# EAGLE schematic LilyTiny_PB (EAGLE 6.0)
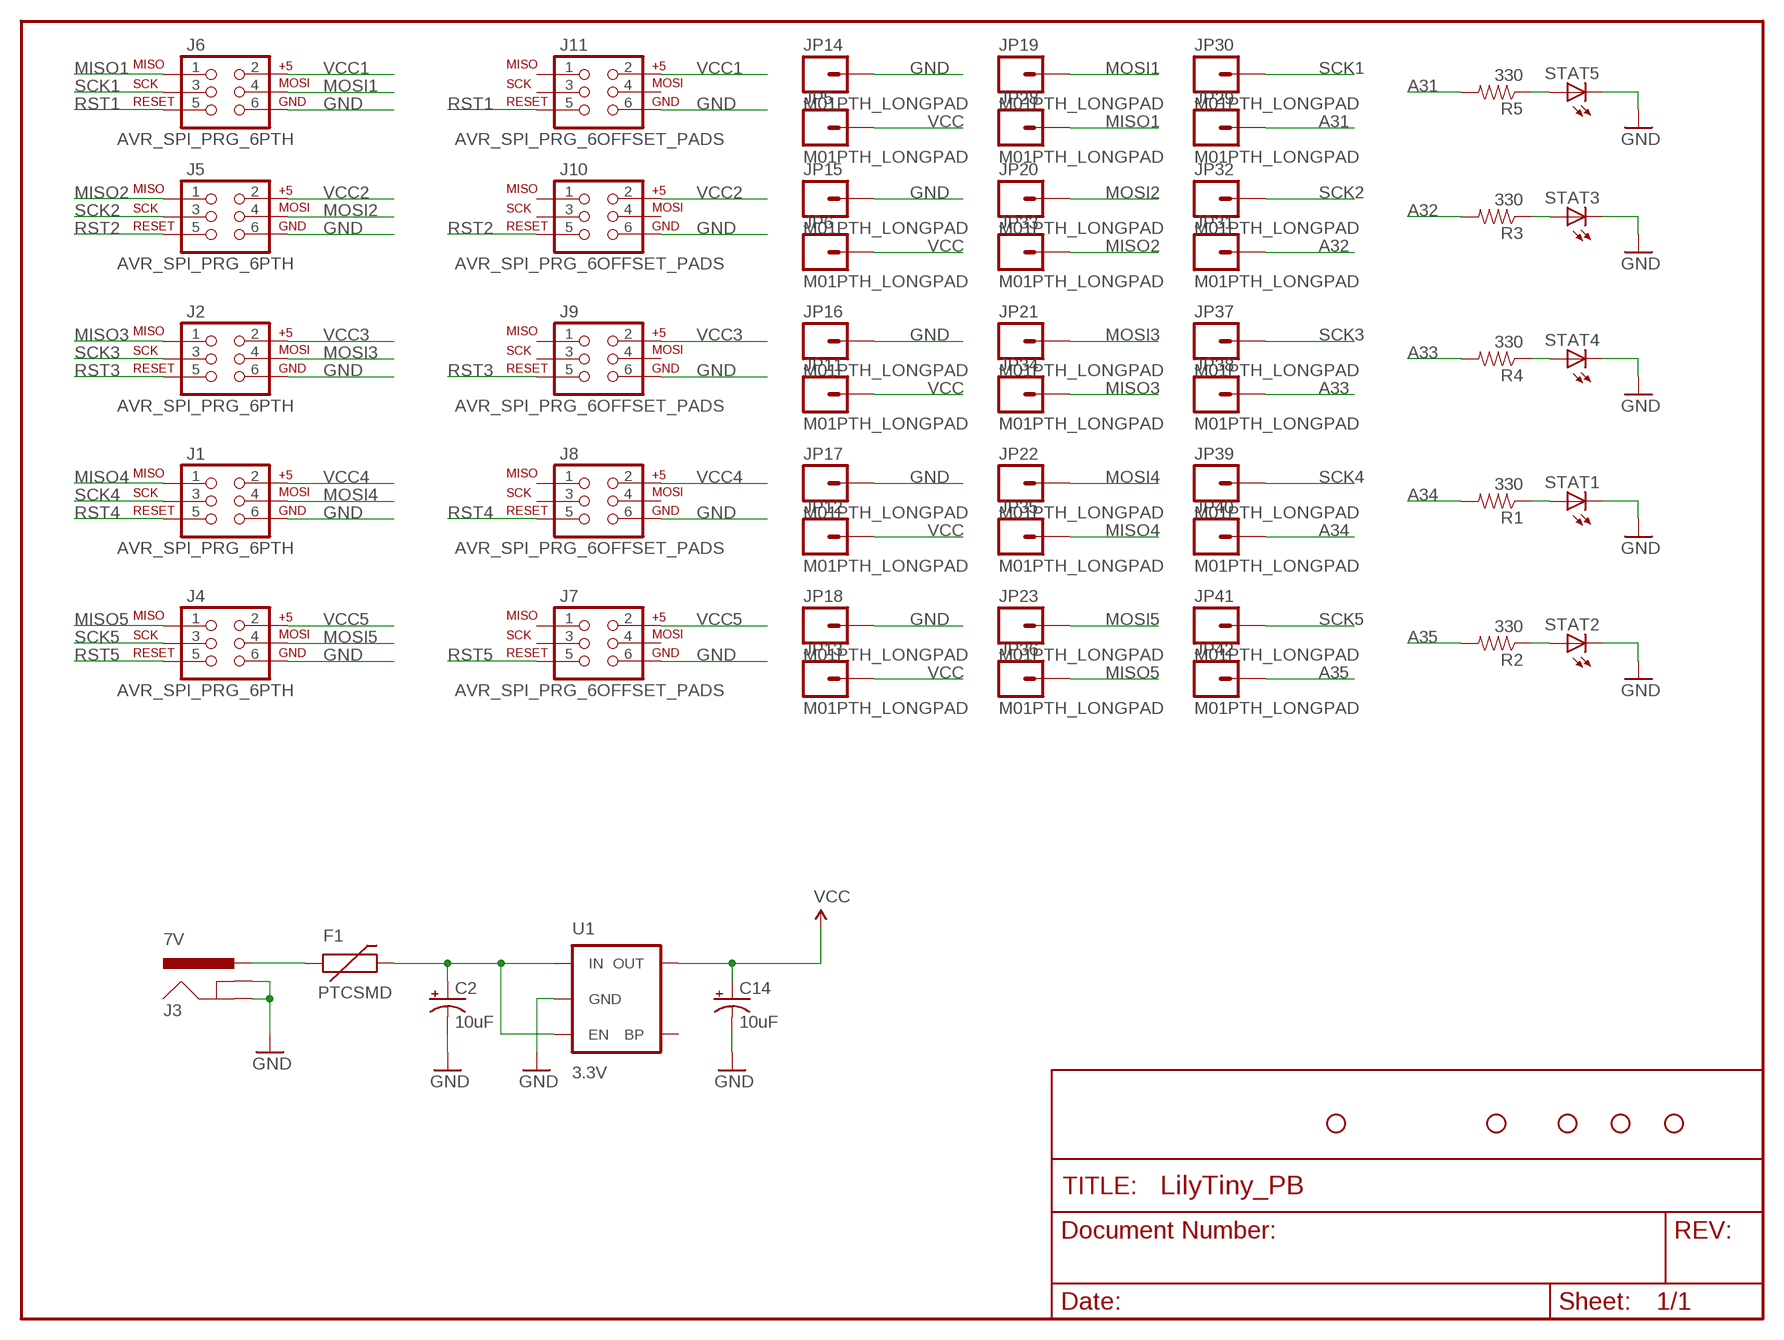
[diagram p0: schematic, sheet 1]

## Parts
C2  10uF  CAP_POL1206  [EIA3216]
C14  10uF  CAP_POL1206  [EIA3216]
F1  PTCSMD  [PTC-1206]
J1  AVR_SPI_PRG_6PTH  [2X3]
J2  AVR_SPI_PRG_6PTH  [2X3]
J3  7V  POWER_JACKPTH_LOCK  [POWER_JACK_PTH_LOCK]
J4  AVR_SPI_PRG_6PTH  [2X3]
J5  AVR_SPI_PRG_6PTH  [2X3]
J6  AVR_SPI_PRG_6PTH  [2X3]
J7  AVR_SPI_PRG_6OFFSET_PADS  [2X3_OFFSET]
J8  AVR_SPI_PRG_6OFFSET_PADS  [2X3_OFFSET]
J9  AVR_SPI_PRG_6OFFSET_PADS  [2X3_OFFSET]
J10  AVR_SPI_PRG_6OFFSET_PADS  [2X3_OFFSET]
J11  AVR_SPI_PRG_6OFFSET_PADS  [2X3_OFFSET]
JP1  STAND-OFFTIGHT  [STAND-OFF-TIGHT]
JP4  STAND-OFFTIGHT  [STAND-OFF-TIGHT]
JP5  M01PTH_LONGPAD  [1X01_LONGPAD]
JP6  M01PTH_LONGPAD  [1X01_LONGPAD]
JP10  STAND-OFFTIGHT  [STAND-OFF-TIGHT]
JP11  M01PTH_LONGPAD  [1X01_LONGPAD]
JP12  M01PTH_LONGPAD  [1X01_LONGPAD]
JP13  M01PTH_LONGPAD  [1X01_LONGPAD]
JP14  M01PTH_LONGPAD  [1X01_LONGPAD]
JP15  M01PTH_LONGPAD  [1X01_LONGPAD]
JP16  M01PTH_LONGPAD  [1X01_LONGPAD]
JP17  M01PTH_LONGPAD  [1X01_LONGPAD]
JP18  M01PTH_LONGPAD  [1X01_LONGPAD]
JP19  M01PTH_LONGPAD  [1X01_LONGPAD]
JP20  M01PTH_LONGPAD  [1X01_LONGPAD]
JP21  M01PTH_LONGPAD  [1X01_LONGPAD]
JP22  M01PTH_LONGPAD  [1X01_LONGPAD]
JP23  M01PTH_LONGPAD  [1X01_LONGPAD]
JP25  STAND-OFFTIGHT  [STAND-OFF-TIGHT]
JP26  STAND-OFFTIGHT  [STAND-OFF-TIGHT]
JP28  M01PTH_LONGPAD  [1X01_LONGPAD]
JP29  M01PTH_LONGPAD  [1X01_LONGPAD]
JP30  M01PTH_LONGPAD  [1X01_LONGPAD]
JP31  M01PTH_LONGPAD  [1X01_LONGPAD]
JP32  M01PTH_LONGPAD  [1X01_LONGPAD]
JP33  M01PTH_LONGPAD  [1X01_LONGPAD]
JP34  M01PTH_LONGPAD  [1X01_LONGPAD]
JP35  M01PTH_LONGPAD  [1X01_LONGPAD]
JP36  M01PTH_LONGPAD  [1X01_LONGPAD]
JP37  M01PTH_LONGPAD  [1X01_LONGPAD]
JP38  M01PTH_LONGPAD  [1X01_LONGPAD]
JP39  M01PTH_LONGPAD  [1X01_LONGPAD]
JP40  M01PTH_LONGPAD  [1X01_LONGPAD]
JP41  M01PTH_LONGPAD  [1X01_LONGPAD]
JP42  M01PTH_LONGPAD  [1X01_LONGPAD]
R1  330  RESISTOR0603-RES  [0603-RES]
R2  330  RESISTOR0603-RES  [0603-RES]
R3  330  RESISTOR0603-RES  [0603-RES]
R4  330  RESISTOR0603-RES  [0603-RES]
R5  330  RESISTOR0603-RES  [0603-RES]
STAT1  Yellow  LED1206  [LED-1206]
STAT2  Yellow  LED1206  [LED-1206]
STAT3  Yellow  LED1206  [LED-1206]
STAT4  Yellow  LED1206  [LED-1206]
STAT5  Yellow  LED1206  [LED-1206]
U1  3.3V  V_REG_LDOSMD  [SOT23-5]

## Nets
A31: JP29.1 R5.2
A32: JP31.1 R3.2
A33: JP38.1 R4.2
A34: JP40.1 R1.2
A35: JP42.1 R2.2
GND: C2.C(-) C14.C(-) J1.6 J2.6 J3.GND J3.GNDBREAK J4.6 J5.6 J6.6 J7.6 J8.6 J9.6 J10.6 J11.6 JP14.1 JP15.1 JP16.1 JP17.1 JP18.1 STAT1.C STAT2.C STAT3.C STAT4.C STAT5.C U1.2(GND)
MISO1: J6.1 JP28.1
MISO2: J5.1 JP33.1
MISO3: J2.1 JP34.1
MISO4: J1.1 JP35.1
MISO5: J4.1 JP36.1
MOSI1: J6.4 JP19.1
MOSI2: J5.4 JP20.1
MOSI3: J2.4 JP21.1
MOSI4: J1.4 JP22.1
MOSI5: J4.4 JP23.1
N$1: R1.1 STAT1.A
N$2: R2.1 STAT2.A
N$3: R3.1 STAT3.A
N$4: C2.A(+) F1.2 U1.1(IN) U1.3(EN)
N$5: R4.1 STAT4.A
N$6: R5.1 STAT5.A
RAW: F1.1 J3.PWR
RST1: J6.5 J11.5
RST2: J5.5 J10.5
RST3: J2.5 J9.5
RST4: J1.5 J8.5
RST5: J4.5 J7.5
SCK1: J6.3 JP30.1
SCK2: J5.3 JP32.1
SCK3: J2.3 JP37.1
SCK4: J1.3 JP39.1
SCK5: J4.3 JP41.1
VCC: C14.A(+) JP5.1 JP6.1 JP11.1 JP12.1 JP13.1 U1.5(OUT)
VCC1: J6.2 J11.2
VCC2: J5.2 J10.2
VCC3: J2.2 J9.2
VCC4: J1.2 J8.2
VCC5: J4.2 J7.2
Unconnected: J7.1 J7.3 J7.4 J8.1 J8.3 J8.4 J9.1 J9.3 J9.4 J10.1 J10.3 J10.4 J11.1 J11.3 J11.4 U1.4(BP)

## Library data of the parts
C2 C14 = SparkFun:CAP_POL: Capacitor Polarized These are standard SMD and PTH capacitors. Normally 10uF, 47uF, and 100uF in electrolytic and tantalum varieties. Always verify the external diameter of the through hole cap, it varies with capacity, voltage, and manufacturer. The EIA devices should be standard.
F1 = SparkFun:PTC: Resettable Fuse PTC Resettable Fuse. Spark Fun Electronics SKU : COM-08357
J1 J2 J4-J11 = SparkFun:AVR_SPI_PRG_6: AVR ISP 6 Pin This is the reduced ISP connector for AVR programming. Common on Arduino. This footprint will take up less PCB space and can be used with a 10-pin to 6-pin adapter such as SKU: BOB-08508
J3 = SparkFun:POWER_JACK: Power Jack This is the standard 5.5mm barrel jack for power. The PTH is the most common, proven, reliable, footprint. All others are experimental. The Slot footprint only works if the mill layer is transmitted to the PCB fab house so be warned. Spark Fun Electronics SKU : PRT-00119. Mating wall wart : TOL-00298 (and others)
JP1 JP4 JP10 JP25 JP26 = SparkFun:STAND-OFF: Stand Off This is the mechanical footprint for a #4 phillips button head screw. Use the keepout ring to avoid running the screw head into surrounding components. SKU : PRT-00447
JP5 JP6 JP11-JP23 JP28-JP42 = Testing:M01: Header 1 Standard 1-pin 0.1" header. Use with straight break away headers (SKU : PRT-00116), right angle break away headers (PRT-00553), swiss pins (PRT-00743), machine pins (PRT-00117), and female headers (PRT-00115).
R1-R5 = SparkFun:RESISTOR: Resistor Basic schematic elements and footprints for 0603, 1206, and PTH resistors.
STAT1-STAT5 = SparkFun:LED: LEDs Standard schematic elements and footprints for 5mm, 3mm, 1206, and 0603 sized LEDs. 5mm - Spark Fun Electronics SKU : COM-00529 (and others)
U1 = SparkFun:V_REG_LDO: Voltage Regulator LDO Standard 150mA LDO voltage regulator in SOT-23 layout. Micrel part MIC5205. BP (by-pass) pin is used to lower output noise with 470pF cap.